# Altium project Project_Buran.PrjPcb
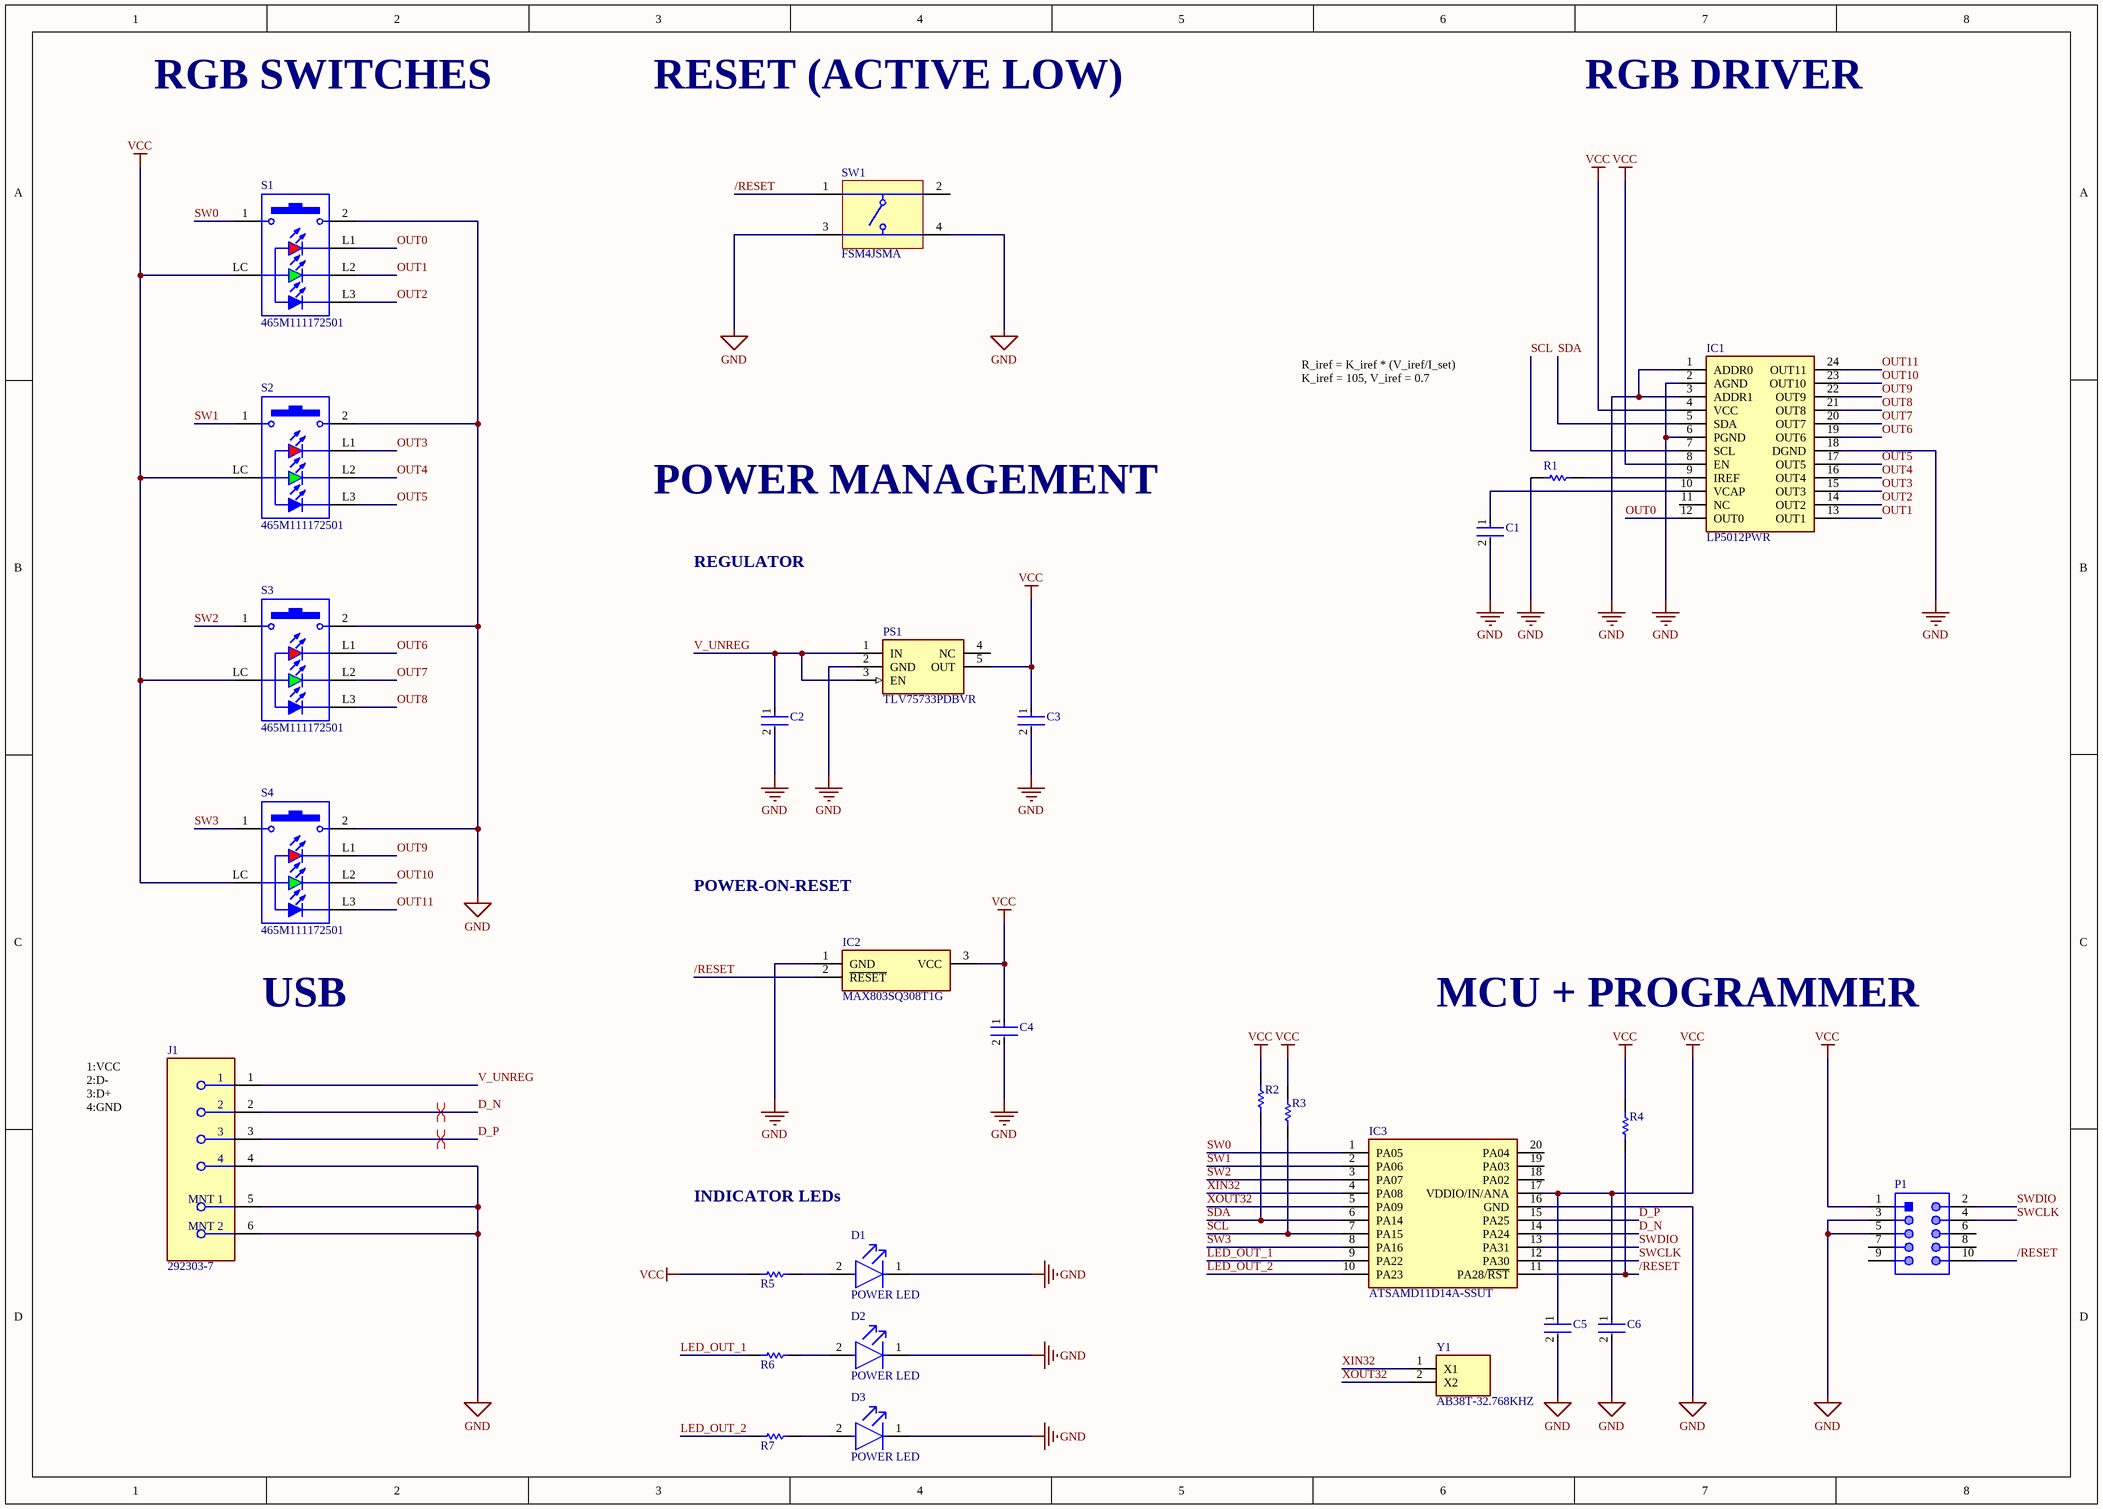
[diagram p0: project_buran_schematic.SchDoc]
1 sheet, 28 parts. Net scope: global (net labels, ports and power ports of the same name join across sheets).
Board file: project_buran_a01.PcbDoc

## Sheet project_buran_schematic.SchDoc
size A3

### Parts
C1  GRM188R60J106ME47D  [FP-GRM188-0_1-e0_2_0_55-IPC_A]  (value not drawn)
C2  GRM188R60J106ME47D  [FP-GRM188-0_1-e0_2_0_55-IPC_A]  (value not drawn)
C3  GRM188R60J106ME47D  [FP-GRM188-0_1-e0_2_0_55-IPC_A]  (value not drawn)
C4  GRM188R60J106ME47D  [FP-GRM188-0_1-e0_2_0_55-IPC_A]  (value not drawn)
C5  GRM188R60J106ME47D  [FP-GRM188-0_1-e0_2_0_55-IPC_A]  (value not drawn)
C6  GRM188R60J106ME47D  [FP-GRM188-0_1-e0_2_0_55-IPC_A]  (value not drawn)
D1  POWER LED  [FP-LTST-C190GKT-MFG]
D2  POWER LED  [FP-LTST-C190GKT-MFG]
D3  POWER LED  [FP-LTST-C190GKT-MFG]
IC1  LP5012PWR  [SOP65P640X120-24N]
IC2  MAX803SQ308T1G  [SOT65P220X100-3N]
IC3  ATSAMD11D14A-SSUT  [SOIC127P1032X265-20N]
J1  292303-7  [FP-292303-7-MFG]
P1  61301021121  [61301021121]  (value not drawn)
PS1  TLV75733PDBVR  [SOT95P280X145-5N]
R1  CRCW0603110RFKEA  [RESC1609X50X30NL10T20]  (value not drawn)
R2  CRCW0603110RFKEA  [RESC1609X50X30NL10T20]  (value not drawn)
R3  CRCW0603110RFKEA  [RESC1609X50X30NL10T20]  (value not drawn)
R4  CRCW0603110RFKEA  [RESC1609X50X30NL10T20]  (value not drawn)
R5  CRCW0603110RFKEA  [RESC1609X50X30NL10T20]  (value not drawn)
R6  CRCW0603110RFKEA  [RESC1609X50X30NL10T20]  (value not drawn)
R7  CRCW0603110RFKEA  [RESC1609X50X30NL10T20]  (value not drawn)
S1  465M111172501  [465M111172501]
S2  465M111172501  [465M111172501]
S3  465M111172501  [465M111172501]
S4  465M111172501  [465M111172501]
SW1  FSM4JSMA  [TECO-FSM4JSMA_V]
Y1  AB38T-32.768KHZ  [AB38T32768KHZ]

### Nets
GND: C1.2 C2.2 C3.2 C4.2 C5.2 C6.2 D1.1(C) D2.1(C) D3.1(C) IC1.1(ADDR0) IC1.2(AGND) IC1.3(ADDR1) IC1.6(PGND) IC1.18(DGND) IC2.1(GND) IC3.16(GND) J1.4 J1.5(MNT_1) J1.6(MNT_2) P1.3 P1.5 PS1.2(GND) R1.1 S1.2 S2.2 S3.2 S4.2 SW1.3 SW1.4
VCC: C3.1 C4.1 C5.1 C6.1 IC1.4(VCC) IC1.8(EN) IC2.3(VCC) IC3.17(VDDIO/IN/ANA) P1.1 PS1.5(OUT) R2.2 R3.2 R4.2 R5.2 S1.LC S2.LC S3.LC S4.LC
/RESET: IC2.2(~{RESET}) IC3.11(PA28/~{RST}) P1.10 R4.1 SW1.1
D_N: IC3.14(PA24) J1.2
D_P: IC3.15(PA25) J1.3
LED_OUT_1: IC3.9(PA22) R6.2
LED_OUT_2: IC3.10(PA23) R7.2
OUT0: IC1.12(OUT0) S1.L1
OUT1: IC1.13(OUT1) S1.L2
OUT2: IC1.14(OUT2) S1.L3
OUT3: IC1.15(OUT3) S2.L1
OUT4: IC1.16(OUT4) S2.L2
OUT5: IC1.17(OUT5) S2.L3
OUT6: IC1.19(OUT6) S3.L1
OUT7: IC1.20(OUT7) S3.L2
OUT8: IC1.21(OUT8) S3.L3
OUT9: IC1.22(OUT9) S4.L1
OUT10: IC1.23(OUT10) S4.L2
OUT11: IC1.24(OUT11) S4.L3
SCL: IC1.7(SCL) IC3.7(PA15) R3.1
SDA: IC1.5(SDA) IC3.6(PA14) R2.1
SW0: IC3.1(PA05) S1.1
SW1: IC3.2(PA06) S2.1
SW2: IC3.3(PA07) S3.1
SW3: IC3.8(PA16) S4.1
SWCLK: IC3.12(PA30) P1.4
SWDIO: IC3.13(PA31) P1.2
V_UNREG: C2.1 J1.1 PS1.1(IN) PS1.3(EN)
XIN32: IC3.4(PA08) Y1.1(X1)
XOUT32: IC3.5(PA09) Y1.2(X2)
NetC1_1: C1.1 IC1.10(VCAP)
NetD1_2: D1.2(A) R5.1
NetD2_2: D2.2(A) R6.1
NetD3_2: D3.2(A) R7.1
NetIC1_9: IC1.9(IREF) R1.2

Not connected (* = marked no-connect by the designer): IC1 11(NC); IC3 18(PA02) 19(PA03) 20(PA04); P1 6 7 8 9; PS1 4(NC); SW1 2

### Layout directives
differential pair: D_N, D_P

### Notes on the sheet
- RGB SWITCHES
- RESET (ACTIVE LOW)
- RGB DRIVER
- R_iref = K_iref * (V_iref/I_set)
  K_iref = 105, V_iref = 0.7
- POWER MANAGEMENT
- REGULATOR
- POWER-ON-RESET
- USB
- MCU + PROGRAMMER
- 1:VCC
  2:D-
  3:D+
  4:GND
- INDICATOR LEDs

### Library data of the parts
C1-C6 = CMP-2006-02792-2: Chip Multilayer Ceramic Capacitors for General Purpose, 0603, 10uF, X5R, 15%, 20%, 6.3V; Packaging: Tape and Reel; Voltage Rating (DC): 6.3V; Width: 0.031inch; Termination: SMD/SMT; Dielectric: X5R; Package Quantity: 4000; Voltage Rating: 6.3V; Capacitance: 10uF; Case/Package: 0603; Min Operating Temperature: -55°C; Voltage: 6.3V; Length: 1.6mm; Thickness: 0.035inch; Lead Free: Lead Free; Depth: 0.8mm; Case Code (Imperial): 0603; Max Operating Temperature: 85°C; Material: Ceramic; Height: 0.8mm; Tolerance: 20%; Mount: Surface Mount; REACH SVHC: No SVHC; Radiation Hardening: No; Case Code (Metric): 1608
D1-D3 = CMP-22017-000005-2: LED GREEN CLEAR CHIP SMD; Dominant Wavelength: 569nm; Reverse Voltage: 5V; Lens Color: Colorless; Viewing Angle: 130°; Voltage: 2V; Forward Current: 30mA; Power Dissipation: 100mW; Luminous Intensity: 6mcd; Number of LEDs: 1; Forward Voltage: 2.1V; Wavelength: 565nm; Test Current: 10mA; Min Operating Temperature: -55°C; Lens Style: Clear; Mount: Surface Mount; Width: 0.8mm; Packaging: Tape and Reel; Lens Transparency: Clear; Case Code (Metric): 1608; Depth: 0.8mm; Case Code (Imperial): 0603; Case/Package: 0603; Number of Pins: 2; Max Operating Temperature: 85°C; Lead Free: Lead Free; Number of Elements: 1; Length: 1.6mm; Height: 0.8mm; Package Quantity: 1; Power Rating: 100mW; Radiation Hardening: No; Illumination Color: Green; Color: Green
IC1 = LP5012PWR: Integrated Circuit; Manufacturer_Name: Texas Instruments; Datasheet Link: https://www.ti.com/lit/ds/symlink/lp5012.pdf?ts=1615929314042&ref_url=https%253A%252F%252Fwww.mouser.co.uk%252F; Height: 1.2mm; Manufacturer_Part_Number: LP5012PWR; Mouser Part Number: 595-LP5012PWR; Mouser Price/Stock: https://www.mouser.co.uk/ProductDetail/Texas-Instruments/LP5012PWR/?qs=T94vaHKWudSL6jLwBy12Hg%3D%3D
IC2 = MAX803SQ308T1G: Integrated Circuit; Manufacturer_Name: ON Semiconductor; Datasheet Link: http://www.onsemi.com/pub/Collateral/MAX803-D.PDF; Height: 1mm; Manufacturer_Part_Number: MAX803SQ308T1G; Mouser Part Number: 863-MAX803SQ308T1G; Mouser Price/Stock: https://www.mouser.co.uk/ProductDetail/ON-Semiconductor/MAX803SQ308T1G?qs=aSUclzrs14xj4ys5ck7Tew%3D%3D; Arrow Part Number: MAX803SQ308T1G; Arrow Price/Stock: https://www.arrow.com/en/products/max803sq308t1g/on-semiconductor
IC3 = ATSAMD11D14A-SSUT: Integrated Circuit; Manufacturer_Name: Microchip; Datasheet Link: http://ww1.microchip.com/downloads/en/devicedoc/atmel-42363-sam-d11_datasheet.pdf; Height: 2.65mm; Manufacturer_Part_Number: ATSAMD11D14A-SSUT; Mouser Part Number: 556-ATSAMD11D14ASSUT; Mouser Price/Stock: https://www.mouser.co.uk/ProductDetail/Microchip-Technology-Atmel/ATSAMD11D14A-SSUT/?qs=lrqjml%252Bjt8f8EFewxXrzCw%3D%3D; Arrow Part Number: ATSAMD11D14A-SSUT; Arrow Price/Stock: https://www.arrow.com/en/products/atsamd11d14a-ssut/microchip-technology
J1 = CMP-03360-000008-1: CONN RCPT USB2.0 TYPEA 4P SMD RA; Manufacturer: TE Connectivity; Is Female: yes; Current Rating: 1A; Number Of Contacts: 4; Voltage Rating: 30V; Conn Orientation: Right Angle; Shielding: true; Digikey Description: CONN RCPT USB2.0 TYPEA 4P SMD RA; Manufacturer Part Number: 292303-7; Automotive: No; Category: Conn; Temperature: -55°C to +85°C; ComponentLink2Description: Datasheet; Mouser Description: USB Connectors USB A R/A Recpt Assy SMT; Contact Material: Gold,Nickel; Package: 292303-7; Device Class L3: unset; Octopart: https://octopart.com/292303-7-te+connectivity-42840369; RoHS: TRUE; Device Class L2: USB Connectors; ComponentLink2URL: https://www.te.com/usa-en/product-292303-7.html?te_bu=Cor&te_type=other&te_campaign=oct_glo_cor-oct-global-oth-prtnr-fy19-oct-octo-buy-bom_sma-298_2&elqCampaignId=35216; Temperature Range Low: -55°C; Usb Standard: USB 2.0; Temperature Range High: +85°C; Lead Free: Yes; Device Class L1: Connectors
P1 = CMP-1502-01084-1: THT Vertical Pin Header WR-PHD, Pitch 2.54 mm, Dual Row, 10 pins; Manufacturer: Wurth Elektronik; Working Voltage: 250VAC; Pitch: 2.54mm; Contact Resistance: 20mOhm; Gender: Male; Rated Current: 3A; Withstanding Voltage: 500VAC; Pin Number: 10; Operating Temperature: -40to105degC; Mounting Technology: THT; Publisher: WurthElektronik; Manufacturer URL: http://www.we-online.de; Part Number: 61301021121; Row Number: Dual; Packaging: Bag; Orientation: Vertical; Package Reference: 61301021121; Datasheet URL: https://katalog.we-online.de/em/datasheet/6130xx21121.pdf
PS1 = TLV75733PDBVR: Power Supply; Manufacturer_Name: Texas Instruments; Datasheet Link: http://www.ti.com/lit/gpn/tlv757p; Height: 1.45mm; Manufacturer_Part_Number: TLV75733PDBVR; Mouser Part Number: 595-TLV75733PDBVR; Mouser Price/Stock: https://www.mouser.co.uk/ProductDetail/Texas-Instruments/TLV75733PDBVR/?qs=y6ZabgHbY%252BwAAzSntTW34w%3D%3D; Arrow Part Number: TLV75733PDBVR; Arrow Price/Stock: https://www.arrow.com/en/products/tlv75733pdbvr/texas-instruments
R1-R7 = CMP-2000-03854-1: Manufacturer: Vishay Dale; Part Number: CRCW0603110RFKEA
S1-S4 = 465M111172501: WS-PBTL Illuminated THT Push Button Switch, Red & Green & Blue; Operation Force: 200gf; Rated Voltage: 12VDC; Rated Current: 100mA; ComponentLink1Description: Manufacturer; ComponentLink1URL: http://www.we-online.de; ComponentLink2Description: Datasheet; ComponentLink2URL: https://katalog.we-online.com/em/datasheet/465M111172501.pdf; Published Date: September 2019; Publisher: Wurth Elektronik; Contact Material: Copper Alloy; Emitting Color: Red & Green & Blue; Mounting Technology: THT; Contact Plating: Gold; Packaging: ESD Tray; Part Number: 465M111172501; Size: 15x15mm; Operating Temperature: -40 to +85degC; Terminal Plating: Tin; Terminal Material: Copper Alloy
SW1 = CMP-2000-05602-2: Swicth, SPST, 24 V, -35 to 85 degC, 4-Pin SMD, RoHS, Tape and Reel; Manufacturer: TE Connectivity; Switch Travel: 0.25mm; Mechanical Life: 100000Cycles; Contact Current Rating: 50mA; Operating Force: 1.57N; Actuator Material: Polyamide; Contact Resistance: 100mOhm; Voltage Rating: 24V; Illumination Type: Illuminated; Actuator Length: 0.055inch; Max Voltage Rating (DC): 12V; Case\/Package: SMD/SMT; Orientation: Straight; Datasheet URL: http://www.te.com/commerce/DocumentDelivery/DDEController?Action=showdoc&DocId=Customer+Drawing%7F2-1437565-7%7FV%7Fpdf%7FEnglish%7FENG_CD_2-1437565-7_V.pdf%7F4-1437565-2; Min Operating Temperature: -35degC; Packaging: LoosePiece; Termination: GullWing; Throw Configuration: SPST; Package Description: 4-Pin Surface Mount Device, Body 6 x 6 mm, Pitch 4.5 mm; Mounting Technology: SurfaceMount; Contact Plating: Silver; Datasheet Version: Rev. V, 02/2015; RoHSCompliant: true; Max Operating Temperature: 85degC; Length: 6mm; Voltage Rating (DC): 24V; Electrical Life: 100000Cycles; Current Rating: 50mA; Package Quantity: 750; Mount: SurfaceMount; Package Reference: FSM4JSMA; Manufacturer URL: http://www.te.com/; Width: 6mm; REACH SVHC: Unknown; Contact Material: CopperAlloy
Y1 = AB38T-32.768KHZ: Crystal or Oscillator; Manufacturer_Name: ABRACON; Datasheet Link: http://www.abracon.com/Resonators/AB38T.pdf; Height: 8.3mm; Manufacturer_Part_Number: AB38T-32.768KHZ; Mouser Part Number: 815-AB38T-32.768KHZ; Mouser Price/Stock: https://www.mouser.co.uk/ProductDetail/ABRACON/AB38T-32768KHZ/?qs=m%252BUhWDcpCfbdp9ovMbeW3g%3D%3D; Arrow Part Number: AB38T-32.768KHZ; Arrow Price/Stock: https://www.arrow.com/en/products/ab38t-32.768khz/abracon